# EAGLE schematic ROV_PCB_V2 (EAGLE 8.0.0)
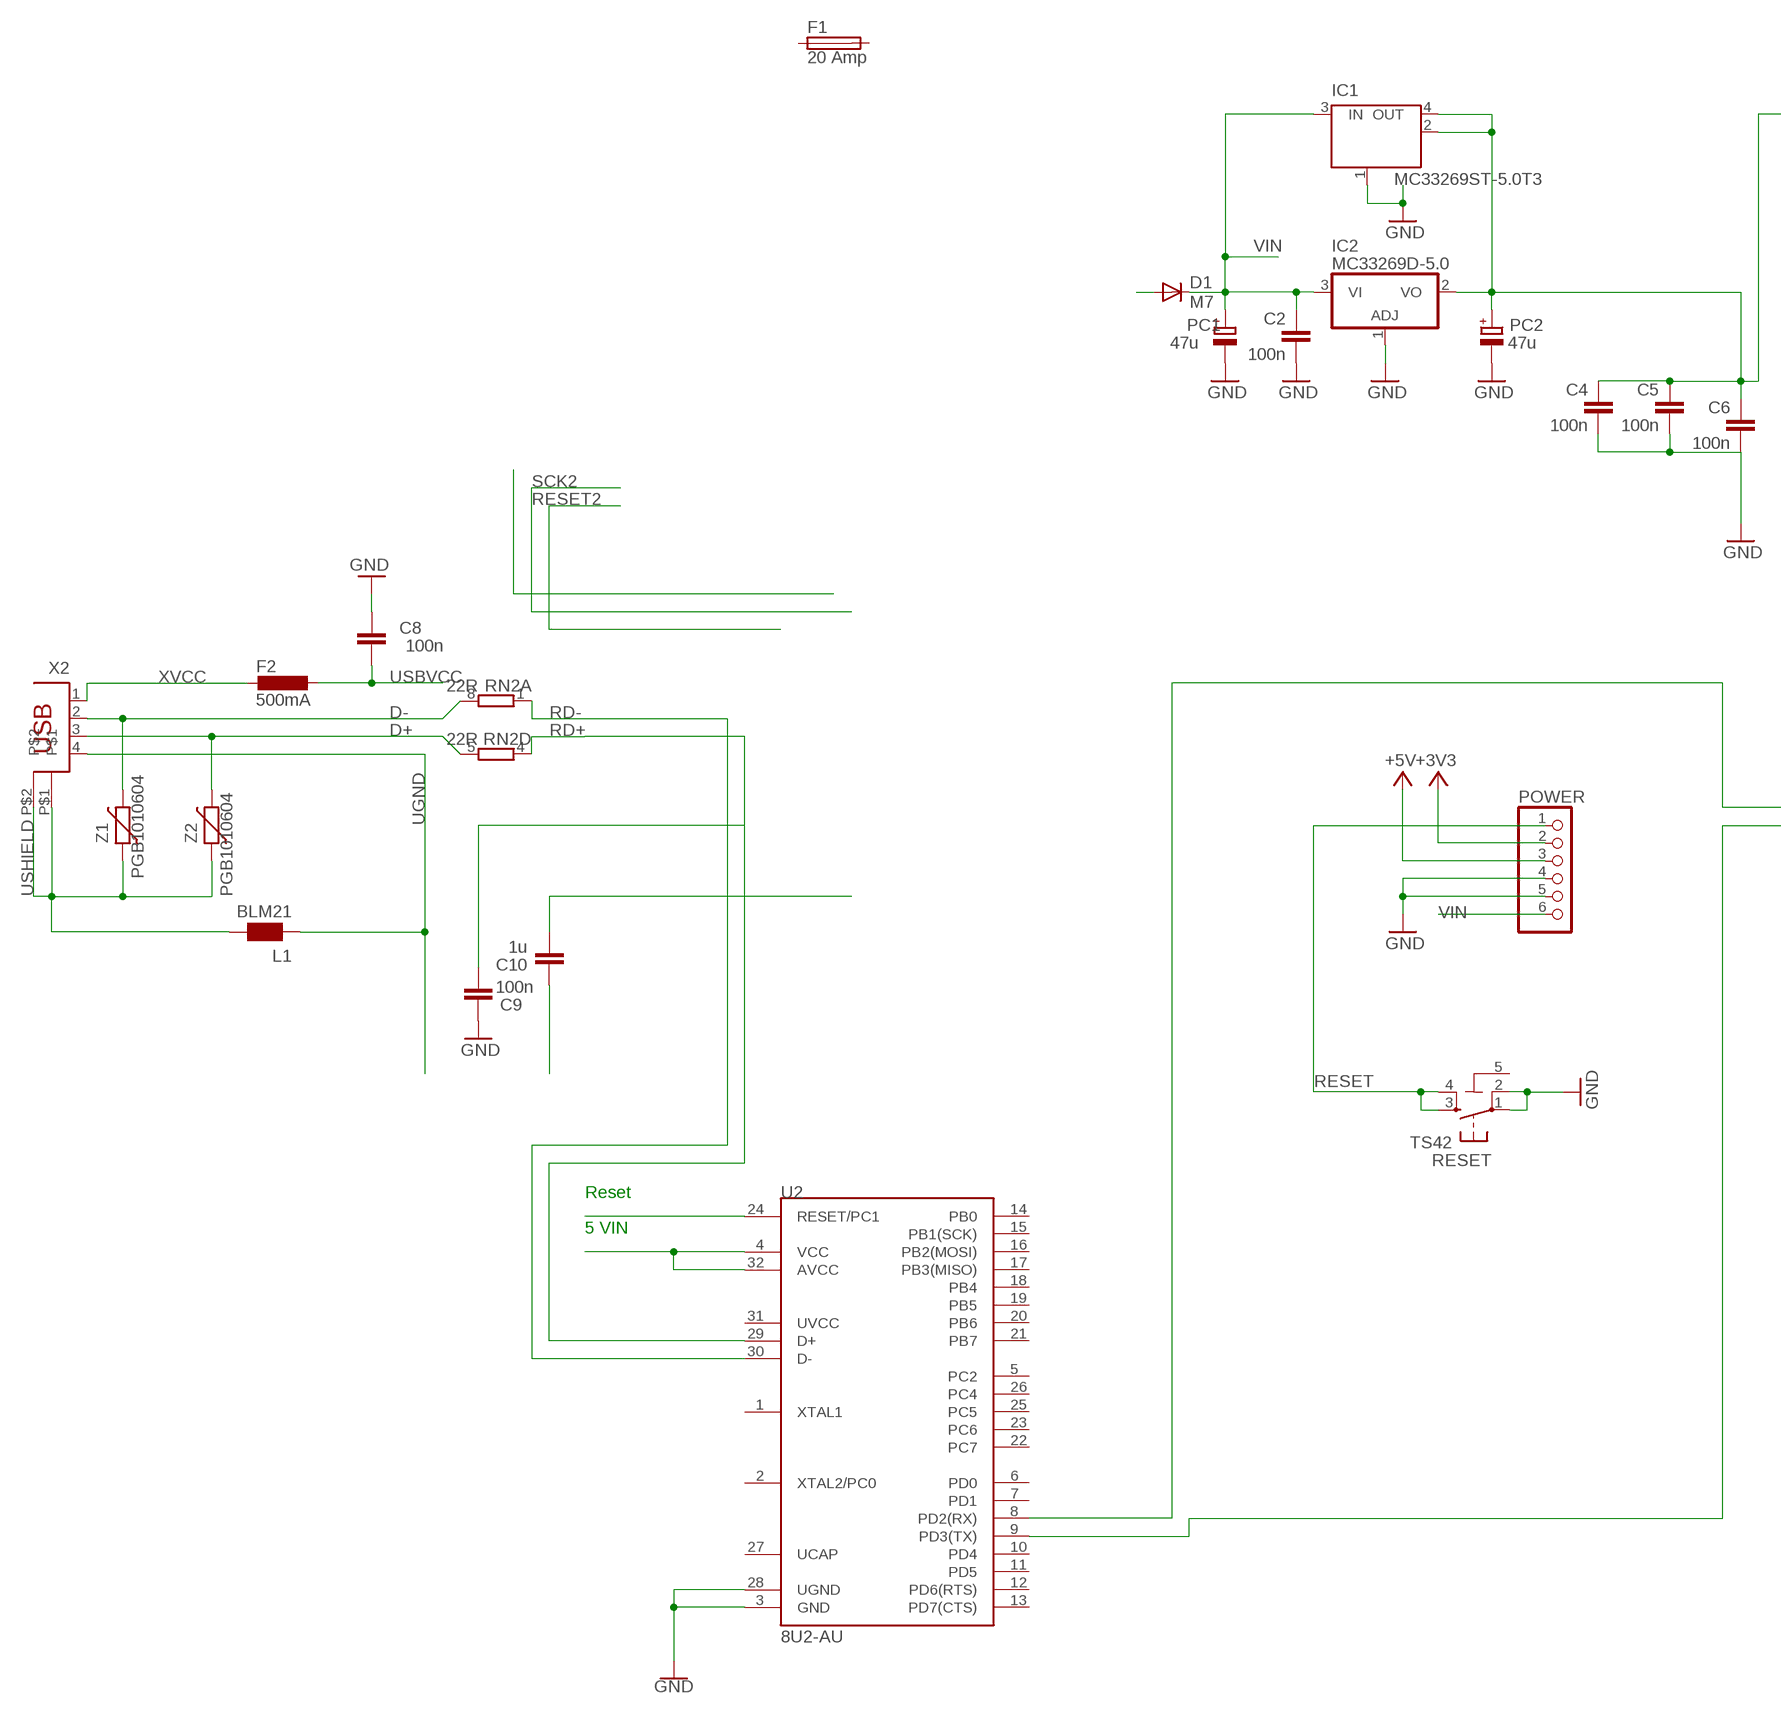
[diagram p0: schematic, sheet 1, part 1 of 2]
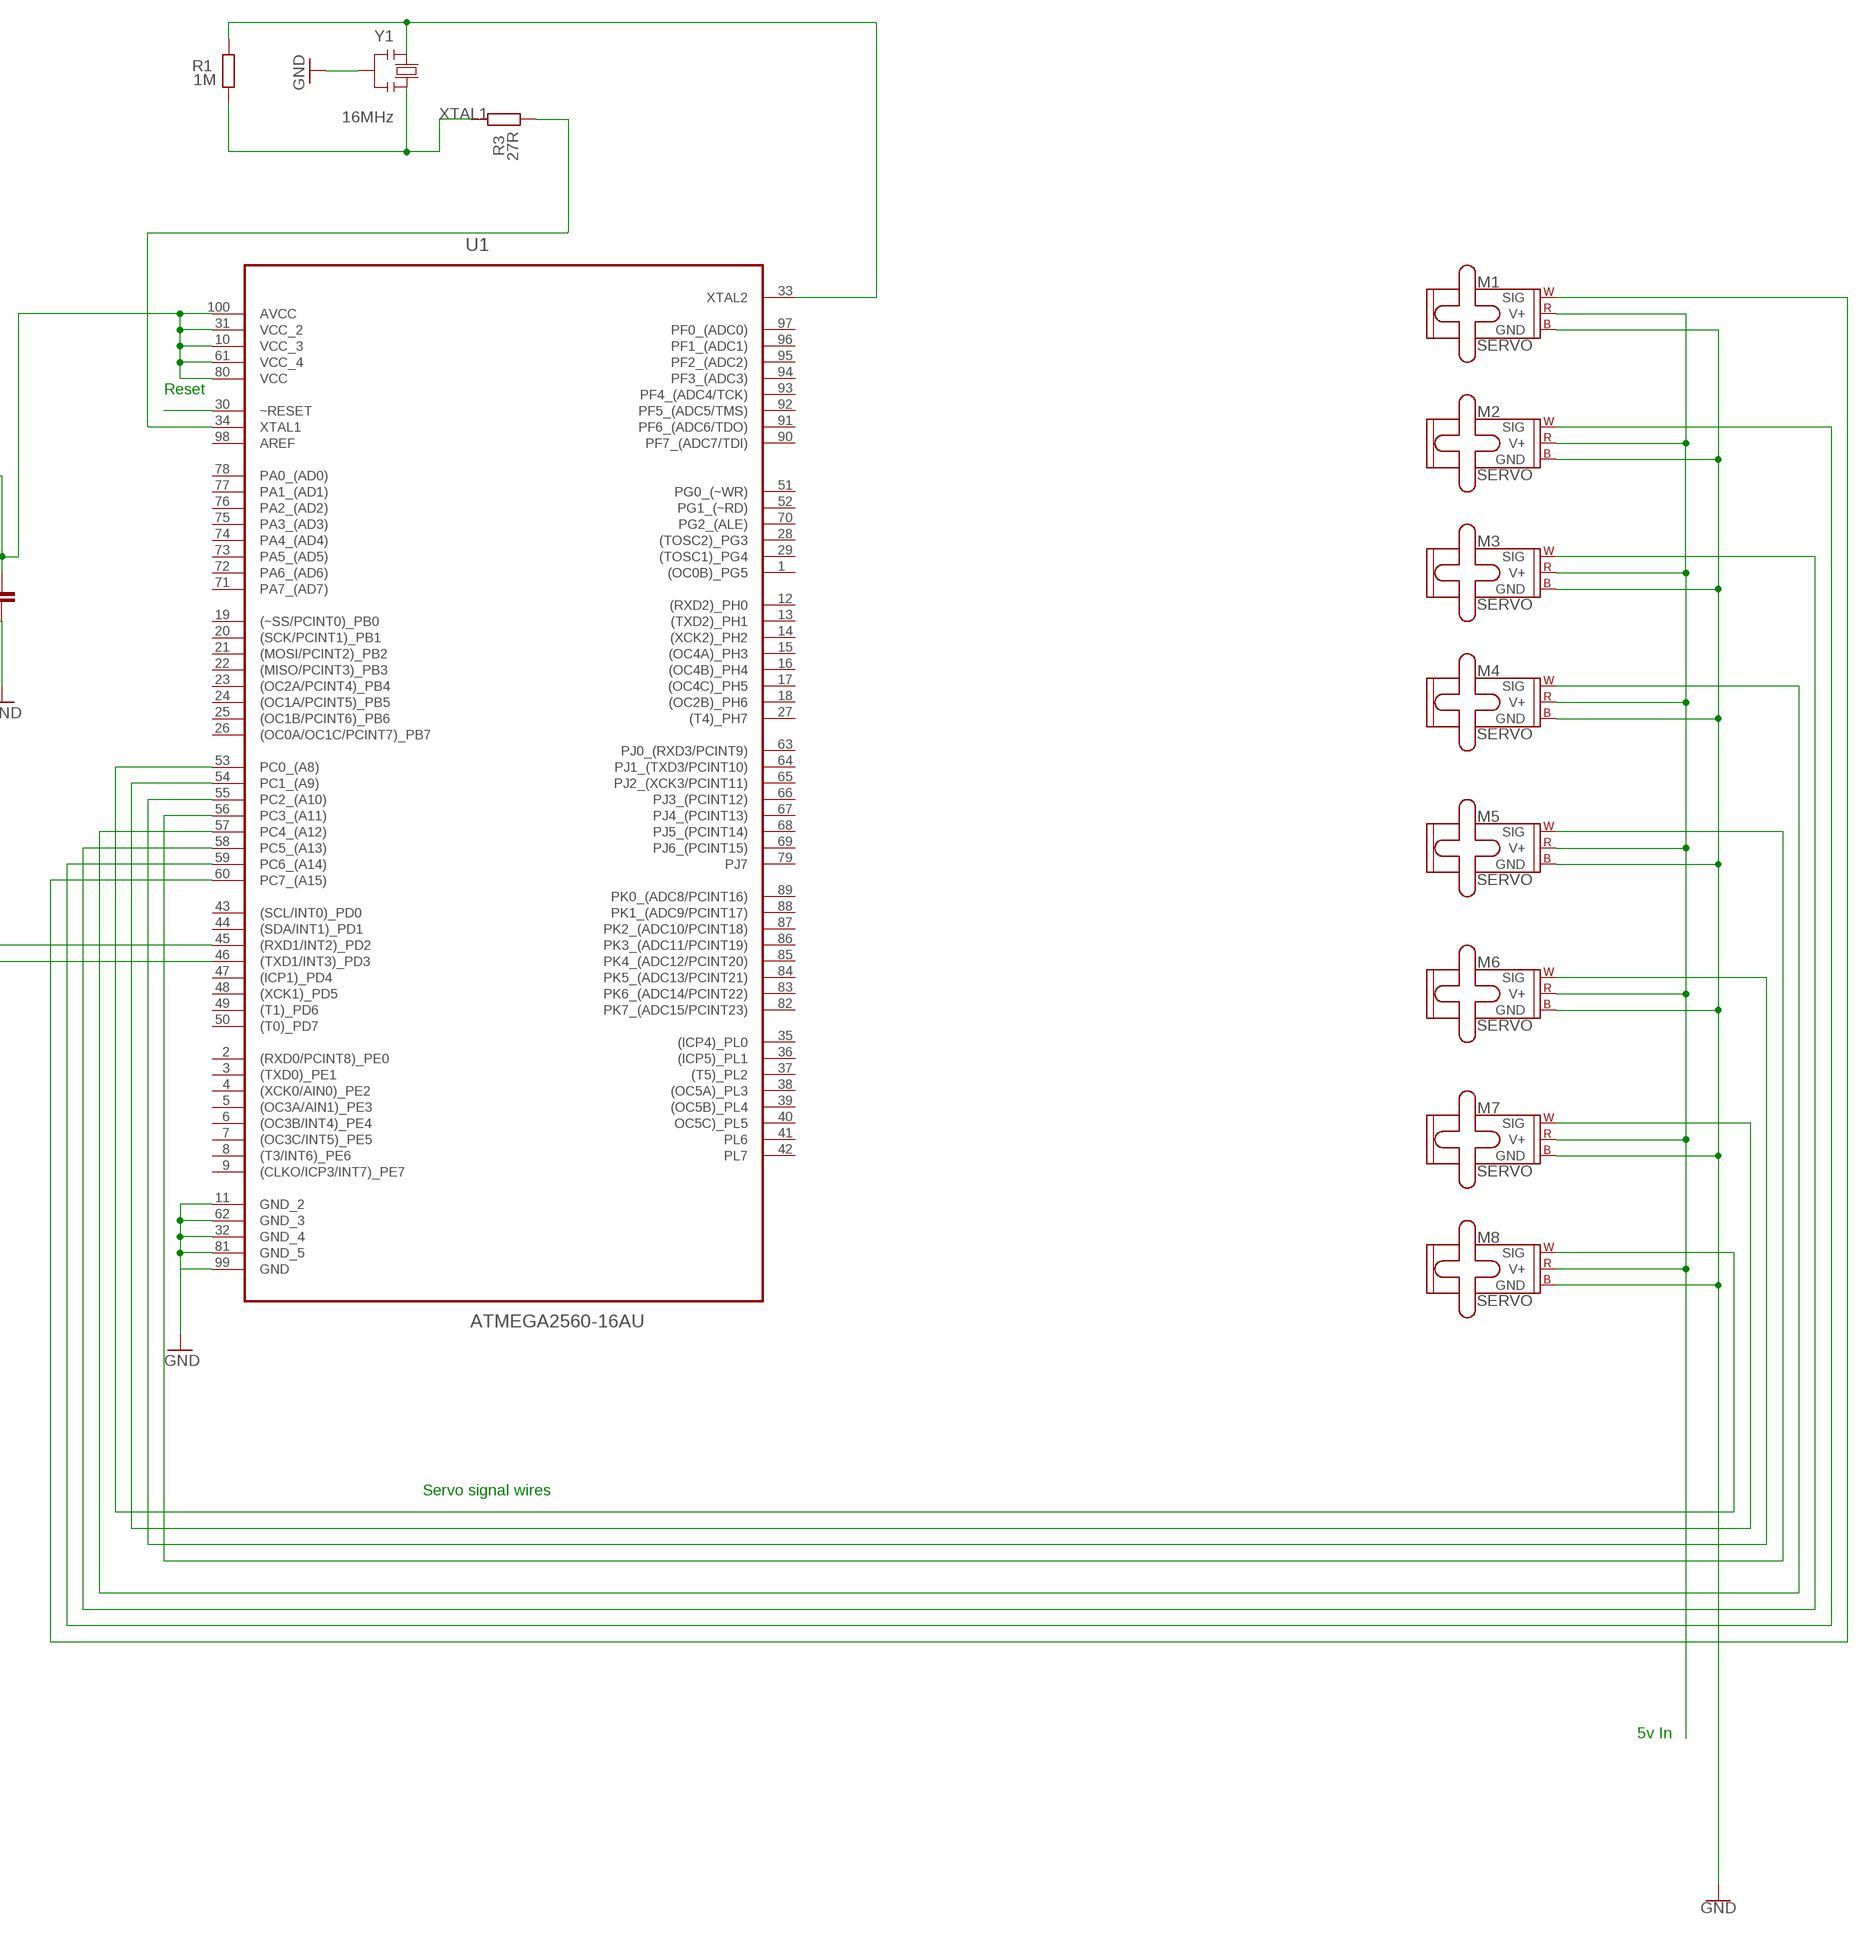
[diagram p1: schematic, sheet 1, part 2 of 2]

## Parts
C2  100n  C-EU0603-RND  [C0603-ROUND]
C4  100n  C-EU0603-RND  [C0603-ROUND]
C5  100n  C-EU0603-RND  [C0603-ROUND]
C6  100n  C-EU0603-RND  [C0603-ROUND]
C8  100n  C-EUC0603  [C0603]
C9  100n  C-EU0603-RND  [C0603-ROUND]
C10  1u  C-EU0603-RND  [C0603-ROUND]
D1  M7  DIODE-SMB  [SMB]
F1  20 Amp  GSH15  [GSH15]
F2  500mA  L-EUL1812  [L1812]
IC1  MC33269ST-5.0T3  MC33269ST-3.3T3  [SOT223]
IC2  MC33269D-5.0  [DPACK]
L1  BLM21  WE-CBF_0805  [0805]
M1  SERVO  [1X03]
M2  SERVO  [1X03]
M3  SERVO  [1X03]
M4  SERVO  [1X03]
M5  SERVO  [1X03]
M6  SERVO  [1X03]
M7  SERVO  [1X03]
M8  SERVO  [1X03]
PC1  47u  CPOL-EUD  [PANASONIC_D]
PC2  47u  CPOL-EUD  [PANASONIC_D]
POWER  PINHD-1X6  [1X06]
R1  1M  R-EU_R0603  [R0603-ROUND]
R3  27R  R-EU_R0603  [R0603-ROUND]
RESET  TS42  [TS42]
RN2  22R  4R-NCAY16  [CAY16]
U1  ATMEGA2560-16AU  [QFP50P1600X1600X120-100N]
U2  8U2-AU  ATMEGA8U2AU  [TQFP32-08_MCU]
X2  PN61729  [PN61729]
Y1  16MHz  RESONATORMU  [RESONATOR]
Z1  PGB1010604  VARISTORCN0603  [CT/CN0603]
Z2  PGB1010604  VARISTORCN0603  [CT/CN0603]

## Nets
+3V3: POWER.2
+5V: C4.1 C5.1 C6.1 IC1.2(OUT) IC1.4(OUT) IC2.2(VO) PC2.+ POWER.3 U1.10(VCC_3) U1.31(VCC_2) U1.61(VCC_4) U1.80(VCC) U1.100(AVCC)
+5V1: U2.29(D+)
D+: RN2.5 X2.3 Z2.2
D-: RN2.8 X2.2 Z1.2
GND: C2.2 C4.2 C5.2 C6.2 C8.2 C9.2 IC1.1(GND/ADJ) IC2.1(ADJ) M1.3(GND) M2.3(GND) M3.3(GND) M4.3(GND) M5.3(GND) M6.3(GND) M7.3(GND) M8.3(GND) PC1.- PC2.- POWER.4 POWER.5 RESET.1 RESET.2 U1.11(GND_2) U1.32(GND_4) U1.62(GND_3) U1.81(GND_5) U1.99(GND) U2.3(GND) U2.28(UGND) Y1.2
N$1: U1.30(~RESET)
N$2: M1.2(V+) M2.2(V+) M3.2(V+) M4.2(V+) M5.2(V+) M6.2(V+) M7.2(V+) M8.2(V+)
N$3: U2.24(RESET/PC1)
N$4: M8.1(SIG) U1.53(PC0_(A8))
N$5: M7.1(SIG) U1.54(PC1_(A9))
N$6: M6.1(SIG) U1.55(PC2_(A10))
N$7: M5.1(SIG) U1.56(PC3_(A11))
N$8: M4.1(SIG) U1.57(PC4_(A12))
N$9: M3.1(SIG) U1.58(PC5_(A13))
N$10: M2.1(SIG) U1.59(PC6_(A14))
N$11: M1.1(SIG) U1.60(PC7_(A15))
N$12: U1.45((RXD1/INT2)_PD2) U2.8(PD2(RX))
N$13: U2.4(VCC) U2.32(AVCC)
N$14: C9.1
N$15: U1.46((TXD1/INT3)_PD3) U2.9(PD3(TX))
PWRIN: D1.A
RD+: RN2.4
RD-: RN2.1 U2.30(D-)
RESET: POWER.1 RESET.3 RESET.4
UGND: C10.2 L1.1 X2.4
USBVCC: C8.1 F2.1
USHIELD: L1.2 X2.P$1 X2.P$2 Z1.1 Z2.1
VIN: C2.1 D1.C IC1.3(IN) IC2.3(VI) PC1.+ POWER.6
VUCAP: C10.1
XTAL1: R1.1 R3.2 Y1.3
XTAL1R: R3.1 U1.34(XTAL1)
XTAL2: R1.2 U1.33(XTAL2) Y1.1
XVCC: F2.2 X2.1
Unconnected: F1.1 F1.2 RN2.2 RN2.3 RN2.6 RN2.7 U1.1((OC0B)_PG5) U1.2((RXD0/PCINT8)_PE0) U1.3((TXD0)_PE1) U1.4((XCK0/AIN0)_PE2) U1.5((OC3A/AIN1)_PE3) U1.6((OC3B/INT4)_PE4) U1.7((OC3C/INT5)_PE5) U1.8((T3/INT6)_PE6) U1.9((CLKO/ICP3/INT7)_PE7) U1.12((RXD2)_PH0) U1.13((TXD2)_PH1) U1.14((XCK2)_PH2) U1.15((OC4A)_PH3) U1.16((OC4B)_PH4) U1.17((OC4C)_PH5) U1.18((OC2B)_PH6) U1.19((~SS/PCINT0)_PB0) U1.20((SCK/PCINT1)_PB1) U1.21((MOSI/PCINT2)_PB2) U1.22((MISO/PCINT3)_PB3) U1.23((OC2A/PCINT4)_PB4) U1.24((OC1A/PCINT5)_PB5) U1.25((OC1B/PCINT6)_PB6) U1.26((OC0A/OC1C/PCINT7)_PB7) U1.27((T4)_PH7) U1.28((TOSC2)_PG3) U1.29((TOSC1)_PG4) U1.35((ICP4)_PL0) U1.36((ICP5)_PL1) U1.37((T5)_PL2) U1.38((OC5A)_PL3) U1.39((OC5B)_PL4) U1.40(OC5C)_PL5) U1.41(PL6) U1.42(PL7) U1.43((SCL/INT0)_PD0) U1.44((SDA/INT1)_PD1) U1.47((ICP1)_PD4) U1.48((XCK1)_PD5) U1.49((T1)_PD6) U1.50((T0)_PD7) U1.51(PG0_(~WR)) U1.52(PG1_(~RD)) U1.63(PJ0_(RXD3/PCINT9)) U1.64(PJ1_(TXD3/PCINT10)) U1.65(PJ2_(XCK3/PCINT11)) U1.66(PJ3_(PCINT12)) U1.67(PJ4_(PCINT13)) U1.68(PJ5_(PCINT14)) U1.69(PJ6_(PCINT15)) U1.70(PG2_(ALE)) U1.71(PA7_(AD7)) U1.72(PA6_(AD6)) U1.73(PA5_(AD5)) U1.74(PA4_(AD4)) U1.75(PA3_(AD3)) U1.76(PA2_(AD2)) U1.77(PA1_(AD1)) U1.78(PA0_(AD0)) U1.79(PJ7) U1.82(PK7_(ADC15/PCINT23)) U1.83(PK6_(ADC14/PCINT22)) U1.84(PK5_(ADC13/PCINT21)) U1.85(PK4_(ADC12/PCINT20)) U1.86(PK3_(ADC11/PCINT19)) U1.87(PK2_(ADC10/PCINT18)) U1.88(PK1_(ADC9/PCINT17)) U1.89(PK0_(ADC8/PCINT16)) U1.90(PF7_(ADC7/TDI)) U1.91(PF6_(ADC6/TDO)) U1.92(PF5_(ADC5/TMS)) U1.93(PF4_(ADC4/TCK)) U1.94(PF3_(ADC3)) U1.95(PF2_(ADC2)) U1.96(PF1_(ADC1)) U1.97(PF0_(ADC0)) U1.98(AREF) U2.1(XTAL1) U2.2(XTAL2/PC0) U2.5(PC2) U2.6(PD0) U2.7(PD1) U2.10(PD4) U2.11(PD5) U2.12(PD6(RTS)) U2.13(PD7(CTS)) U2.14(PB0) U2.15(PB1(SCK)) U2.16(PB2(MOSI)) U2.17(PB3(MISO)) U2.18(PB4) U2.19(PB5) U2.20(PB6) U2.21(PB7) U2.22(PC7) U2.23(PC6) U2.25(PC5) U2.26(PC4) U2.27(UCAP) U2.31(UVCC)

## Notes on the sheet
- Reset
- Reset
- 5 VIN
- Servo signal wires
- 5v In

## Power pins joined to a net without a drawn wire
5-GND: RESET.5(5-GND)

## Library data of the parts
C2 C4-C6 C9 C10 = SmartPrj:C-EU: CAPACITOR, European symbol
C8 = rcl:C-EU: CAPACITOR, European symbol
D1 = diode:DIODE-: DIODE
F1 = fuse:GSH15: FUSE HOLDER grid 15mm, 19649 Wickmann; MPN: 64900001039; OC_FARNELL: 1271673; OC_NEWARK: 02P0318
F2 = rcl:L-EU: INDUCTOR, European symbol
IC1 = linear:MC33269ST*: Adjustable Output Low Dropout Voltage Regulator 800 mA Source: http://www.onsemi.com/pub/Collateral/MC33269-D.PDF
IC2 = linear:MC33269?*: Adjustable Output Low Dropout Voltage Regulator 800 mA Source: http://www.onsemi.com/pub/Collateral/MC33269-D.PDF
L1 = wuerth-elektronik:WE-CBF: SMD EMI Suppression Ferrite Beads - excellent anti-EMI properties - low DCR - impedances till 3000 ohms - rated current up to 6 A
M1-M8 = SparkFun-Electromechanical:SERVO: Servo Motor 3-pin connector for a standard servo motor (voltage supply, ground, and control signal.) SparkFun Products Servo - Generic (Sub-Micro Size) <https://www.sparkfun.com/products/9065> (ROB-09065) Servo - Generic High Torque Continuous Rotation (Standard Size) <https://www.sparkfun.com/products/9347> (ROB-09347) Servo - Generic High Torque (Standard Size) <https://www.sparkfun.com/products/11965> (ROB-11965)
PC1 PC2 = rcl:CPOL-EU: POLARIZED CAPACITOR, European symbol
POWER = pinhead:PINHD-1X6: PIN HEADER
R1 R3 = SmartPrj:R-EU_: RESISTOR, European symbol
RESET = st-mod v1.4:TS42: TS42 Dongnan Electronics Tact switch VDC 12V - 50mA
RN2 = resistor-dil:4R-N: Array Chip Resistor Source: RS Component / Phycomp
U1 = Atmel_By_element14_Batch_1-00:ATMEGA2560-16AU: Microcontroller; DESCRIPTION: Microcontroller; MPN: ATMEGA2560-16AU; OC_FARNELL: 1288330; OC_NEWARK: 23M5051; PACKAGE: LQFP-100; SUPPLIER: ATMEL
U2 = SparkFun-Retired:ATMEGA8U2: Atmel 32-pin 8-bit Microcontroller with 8/16/32K Bystes of ISP Flash and USB Controller. ATmega8U2, ATmega16U2, and ATmega32U2 Datasheet SparkFun Products Storefront component: ATMEGA8U2-AU <https://www.sparkfun.com/products/13703> (COM-13703); PROD_ID: IC-10104
X2 = SmartPrj:PN61729: BERG USB connector
Y1 = SmartPrj:RESONATOR
Z1 Z2 = varistor:VARISTOR: VARISTOR

## Net classes
0 default: width 0.15 mm, drill 0.3 mm, clearance 0.15 mm